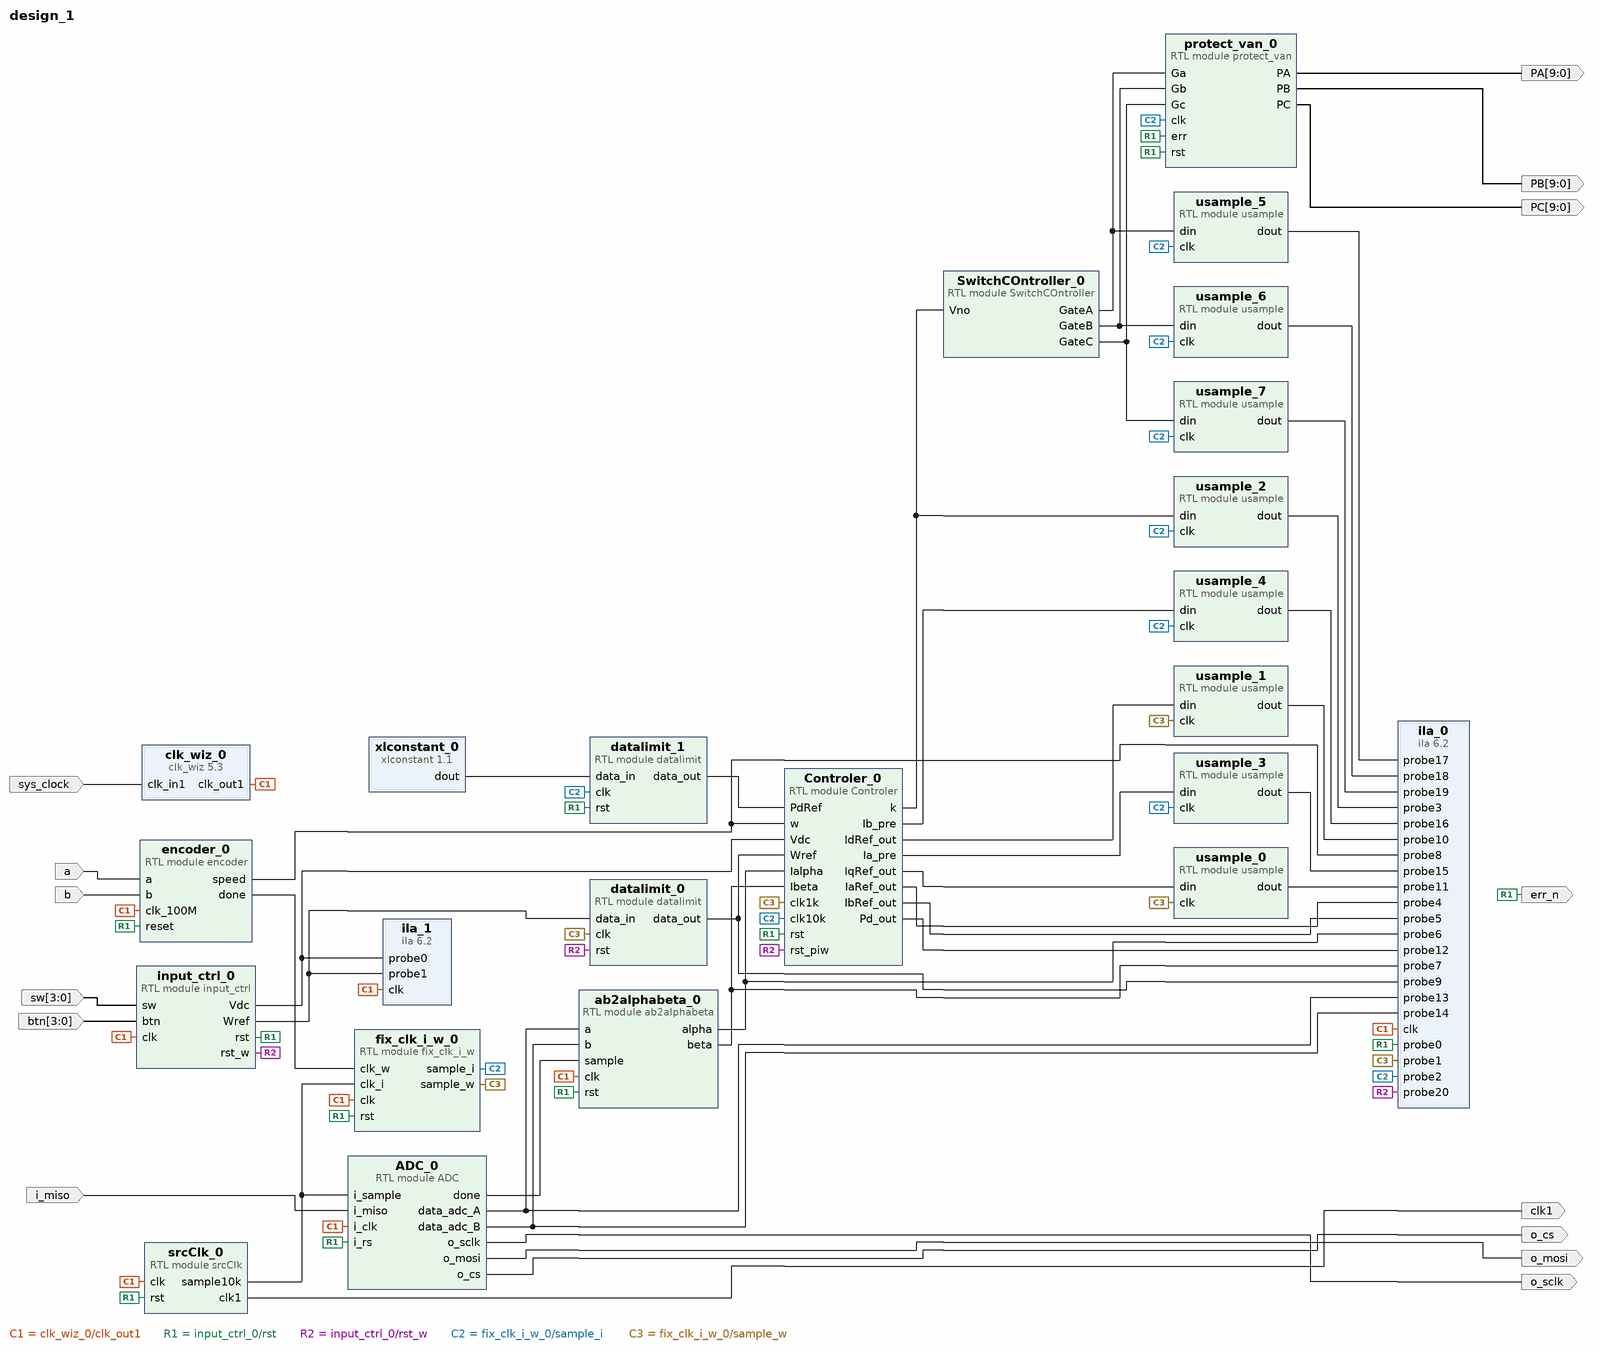
[diagram p0: block diagram of the top level]
# Vivado block design design_1, xc7z020clg400-1, Vivado 2016.4
create_bd_design design_1

create_bd_port -dir I -type clk sys_clock
set_property -dict {CONFIG.FREQ_HZ 125000000 CONFIG.PHASE 0.000} [get_bd_ports sys_clock]
create_bd_port -dir I a
create_bd_port -dir I b
create_bd_port -dir I i_miso
create_bd_port -dir O o_sclk
create_bd_port -dir O o_mosi
create_bd_port -dir O o_cs
create_bd_port -dir I -from 3 -to 0 sw
create_bd_port -dir O err_n
create_bd_port -dir O clk1
create_bd_port -dir I -from 3 -to 0 btn
create_bd_port -dir O -from 9 -to 0 PA
create_bd_port -dir O -from 9 -to 0 PB
create_bd_port -dir O -from 9 -to 0 PC

create_bd_cell -type module -reference encoder encoder_0
create_bd_cell -type ip -vlnv xilinx.com:ip:clk_wiz:5.3 clk_wiz_0
set_property -dict [list \
  CONFIG.CLKIN1_JITTER_PS 80.0 \
  CONFIG.USE_LOCKED false \
  CONFIG.USE_RESET false \
  CONFIG.MMCM_DIVCLK_DIVIDE 1 \
  CONFIG.MMCM_CLKFBOUT_MULT_F 8.000 \
  CONFIG.MMCM_CLKIN1_PERIOD 8.0 \
  CONFIG.USE_BOARD_FLOW true \
  CONFIG.CLK_IN1_BOARD_INTERFACE sys_clock \
  CONFIG.CLKOUT1_JITTER 124.615 \
  CONFIG.CLKOUT1_PHASE_ERROR 96.948 \
] [get_bd_cells clk_wiz_0]
create_bd_cell -type ip -vlnv xilinx.com:ip:xlconstant:1.1 xlconstant_0
set_property -dict {CONFIG.CONST_WIDTH 20 CONFIG.CONST_VAL 4900} [get_bd_cells xlconstant_0]
create_bd_cell -type module -reference datalimit datalimit_0
set_property -dict {CONFIG.delta 6 CONFIG.dWidth 20} [get_bd_cells datalimit_0]
create_bd_cell -type module -reference srcClk srcClk_0
create_bd_cell -type module -reference usample usample_0
create_bd_cell -type module -reference usample usample_1
create_bd_cell -type module -reference usample usample_2
set_property -dict {CONFIG.dWidth 16} [get_bd_cells usample_2]
create_bd_cell -type ip -vlnv xilinx.com:ip:ila:6.2 ila_0
set_property -dict [list \
  CONFIG.C_PROBE20_TYPE 2 \
  CONFIG.C_PROBE19_TYPE 1 \
  CONFIG.C_PROBE18_TYPE 1 \
  CONFIG.C_PROBE17_TYPE 1 \
  CONFIG.C_PROBE16_TYPE 1 \
  CONFIG.C_PROBE15_TYPE 1 \
  CONFIG.C_PROBE14_TYPE 1 \
  CONFIG.C_PROBE13_TYPE 1 \
  CONFIG.C_PROBE12_TYPE 1 \
  CONFIG.C_PROBE11_TYPE 1 \
  CONFIG.C_PROBE10_TYPE 1 \
  CONFIG.C_PROBE9_TYPE 1 \
  CONFIG.C_PROBE8_TYPE 1 \
  CONFIG.C_PROBE7_TYPE 1 \
  CONFIG.C_PROBE6_TYPE 1 \
  CONFIG.C_PROBE5_TYPE 1 \
  CONFIG.C_PROBE4_TYPE 1 \
  CONFIG.C_PROBE3_TYPE 1 \
  CONFIG.C_PROBE0_TYPE 2 \
  CONFIG.C_PROBE19_WIDTH 10 \
  CONFIG.C_PROBE18_WIDTH 10 \
  CONFIG.C_PROBE17_WIDTH 10 \
  CONFIG.C_PROBE16_WIDTH 20 \
  CONFIG.C_PROBE15_WIDTH 20 \
  CONFIG.C_PROBE14_WIDTH 20 \
  CONFIG.C_PROBE13_WIDTH 20 \
  CONFIG.C_PROBE12_WIDTH 20 \
  CONFIG.C_PROBE11_WIDTH 20 \
  CONFIG.C_PROBE10_WIDTH 20 \
  CONFIG.C_PROBE9_WIDTH 20 \
  CONFIG.C_PROBE8_WIDTH 20 \
  CONFIG.C_PROBE7_WIDTH 20 \
  CONFIG.C_PROBE6_WIDTH 20 \
  CONFIG.C_PROBE5_WIDTH 20 \
  CONFIG.C_PROBE4_WIDTH 20 \
  CONFIG.C_PROBE3_WIDTH 16 \
  CONFIG.C_DATA_DEPTH 8192 \
  CONFIG.C_NUM_OF_PROBES 21 \
  CONFIG.C_EN_STRG_QUAL 1 \
  CONFIG.C_PROBE15_MU_CNT 2 \
  CONFIG.C_PROBE14_MU_CNT 2 \
  CONFIG.C_PROBE13_MU_CNT 2 \
  CONFIG.C_PROBE12_MU_CNT 2 \
  CONFIG.C_PROBE11_MU_CNT 2 \
  CONFIG.C_PROBE10_MU_CNT 2 \
  CONFIG.C_PROBE9_MU_CNT 2 \
  CONFIG.C_PROBE8_MU_CNT 2 \
  CONFIG.C_PROBE7_MU_CNT 2 \
  CONFIG.C_PROBE6_MU_CNT 2 \
  CONFIG.C_PROBE5_MU_CNT 2 \
  CONFIG.C_PROBE4_MU_CNT 2 \
  CONFIG.C_PROBE3_MU_CNT 2 \
  CONFIG.C_PROBE2_MU_CNT 2 \
  CONFIG.C_PROBE1_MU_CNT 2 \
  CONFIG.C_PROBE0_MU_CNT 2 \
  CONFIG.ALL_PROBE_SAME_MU_CNT 2 \
  CONFIG.C_ENABLE_ILA_AXI_MON false \
  CONFIG.C_MONITOR_TYPE Native \
] [get_bd_cells ila_0]
create_bd_cell -type module -reference fix_clk_i_w fix_clk_i_w_0
create_bd_cell -type ip -vlnv xilinx.com:ip:ila:6.2 ila_1
set_property -dict [list \
  CONFIG.C_PROBE1_TYPE 1 \
  CONFIG.C_PROBE0_TYPE 1 \
  CONFIG.C_PROBE1_WIDTH 20 \
  CONFIG.C_PROBE0_WIDTH 20 \
  CONFIG.C_NUM_OF_PROBES 2 \
  CONFIG.C_ENABLE_ILA_AXI_MON false \
  CONFIG.C_MONITOR_TYPE Native \
] [get_bd_cells ila_1]
create_bd_cell -type module -reference datalimit datalimit_1
set_property -dict {CONFIG.delta 16 CONFIG.dWidth 20} [get_bd_cells datalimit_1]
create_bd_cell -type module -reference SwitchCOntroller SwitchCOntroller_0
create_bd_cell -type module -reference protect_van protect_van_0
create_bd_cell -type module -reference usample usample_3
create_bd_cell -type module -reference usample usample_4
create_bd_cell -type module -reference usample usample_5
set_property -dict {CONFIG.dWidth 10} [get_bd_cells usample_5]
create_bd_cell -type module -reference usample usample_6
set_property -dict {CONFIG.dWidth 10} [get_bd_cells usample_6]
create_bd_cell -type module -reference usample usample_7
set_property -dict {CONFIG.dWidth 10} [get_bd_cells usample_7]
create_bd_cell -type module -reference ADC ADC_0
set_property -dict {CONFIG.CONTROL2 0x9c30} [get_bd_cells ADC_0]
create_bd_cell -type module -reference Controler Controler_0
create_bd_cell -type module -reference ab2alphabeta ab2alphabeta_0
create_bd_cell -type module -reference input_ctrl input_ctrl_0

# ---- connections ----

connect_bd_net [get_bd_pins encoder_0/speed] [get_bd_pins ila_0/probe8] [get_bd_pins Controler_0/w]
connect_bd_net [get_bd_pins clk_wiz_0/clk_out1] \
  [get_bd_pins encoder_0/clk_100M] [get_bd_pins srcClk_0/clk] [get_bd_pins ila_0/clk] [get_bd_pins fix_clk_i_w_0/clk] \
  [get_bd_pins ila_1/clk] [get_bd_pins ADC_0/i_clk] [get_bd_pins ab2alphabeta_0/clk] [get_bd_pins input_ctrl_0/clk]
connect_bd_net [get_bd_ports sys_clock] [get_bd_pins clk_wiz_0/clk_in1]
connect_bd_net [get_bd_ports a] [get_bd_pins encoder_0/a]
connect_bd_net [get_bd_ports b] [get_bd_pins encoder_0/b]
connect_bd_net [get_bd_ports i_miso] [get_bd_pins ADC_0/i_miso]
connect_bd_net [get_bd_pins ADC_0/o_sclk] [get_bd_ports o_sclk]
connect_bd_net [get_bd_pins ADC_0/o_mosi] [get_bd_ports o_mosi]
connect_bd_net [get_bd_pins ADC_0/o_cs] [get_bd_ports o_cs]
connect_bd_net [get_bd_pins encoder_0/done] [get_bd_pins fix_clk_i_w_0/clk_w]
connect_bd_net [get_bd_ports sw] [get_bd_pins input_ctrl_0/sw]
connect_bd_net [get_bd_pins input_ctrl_0/rst] \
  [get_bd_ports err_n] [get_bd_pins encoder_0/reset] [get_bd_pins srcClk_0/rst] [get_bd_pins ila_0/probe0] \
  [get_bd_pins fix_clk_i_w_0/rst] [get_bd_pins datalimit_1/rst] [get_bd_pins protect_van_0/rst] \
  [get_bd_pins protect_van_0/err] [get_bd_pins ADC_0/i_rs] [get_bd_pins Controler_0/rst] [get_bd_pins ab2alphabeta_0/rst]
connect_bd_net [get_bd_pins input_ctrl_0/rst_w] [get_bd_pins datalimit_0/rst] [get_bd_pins Controler_0/rst_piw] [get_bd_pins ila_0/probe20]
connect_bd_net [get_bd_pins ADC_0/data_adc_A] [get_bd_pins ila_0/probe13] [get_bd_pins ab2alphabeta_0/a]
connect_bd_net [get_bd_pins ADC_0/data_adc_B] [get_bd_pins ila_0/probe14] [get_bd_pins ab2alphabeta_0/b]
connect_bd_net [get_bd_pins ab2alphabeta_0/alpha] [get_bd_pins ila_0/probe6] [get_bd_pins Controler_0/Ialpha]
connect_bd_net [get_bd_pins ab2alphabeta_0/beta] [get_bd_pins ila_0/probe7] [get_bd_pins Controler_0/Ibeta]
connect_bd_net [get_bd_pins input_ctrl_0/Wref] [get_bd_pins datalimit_0/data_in] [get_bd_pins ila_1/probe1]
connect_bd_net [get_bd_pins datalimit_0/data_out] [get_bd_pins ila_0/probe9] [get_bd_pins Controler_0/Wref]
connect_bd_net [get_bd_pins srcClk_0/clk1] [get_bd_ports clk1]
connect_bd_net [get_bd_pins Controler_0/k] [get_bd_pins usample_2/din] [get_bd_pins SwitchCOntroller_0/Vno]
connect_bd_net [get_bd_pins usample_2/dout] [get_bd_pins ila_0/probe3]
connect_bd_net [get_bd_pins usample_1/dout] [get_bd_pins ila_0/probe10]
connect_bd_net [get_bd_pins usample_0/dout] [get_bd_pins ila_0/probe11]
connect_bd_net [get_bd_pins ADC_0/done] [get_bd_pins ab2alphabeta_0/sample]
connect_bd_net [get_bd_pins SwitchCOntroller_0/GateA] [get_bd_pins protect_van_0/Ga] [get_bd_pins usample_5/din]
connect_bd_net [get_bd_pins SwitchCOntroller_0/GateB] [get_bd_pins protect_van_0/Gb] [get_bd_pins usample_6/din]
connect_bd_net [get_bd_pins SwitchCOntroller_0/GateC] [get_bd_pins protect_van_0/Gc] [get_bd_pins usample_7/din]
connect_bd_net [get_bd_pins srcClk_0/sample10k] [get_bd_pins fix_clk_i_w_0/clk_i] [get_bd_pins ADC_0/i_sample]
connect_bd_net [get_bd_ports btn] [get_bd_pins input_ctrl_0/btn]
connect_bd_net [get_bd_pins input_ctrl_0/Vdc] [get_bd_pins ila_1/probe0] [get_bd_pins Controler_0/Vdc]
connect_bd_net [get_bd_pins xlconstant_0/dout] [get_bd_pins datalimit_1/data_in]
connect_bd_net [get_bd_pins protect_van_0/PA] [get_bd_ports PA]
connect_bd_net [get_bd_pins protect_van_0/PB] [get_bd_ports PB]
connect_bd_net [get_bd_pins protect_van_0/PC] [get_bd_ports PC]
connect_bd_net [get_bd_pins datalimit_1/data_out] [get_bd_pins Controler_0/PdRef]
connect_bd_net [get_bd_pins fix_clk_i_w_0/sample_i] \
  [get_bd_pins protect_van_0/clk] [get_bd_pins usample_2/clk] [get_bd_pins ila_0/probe2] [get_bd_pins datalimit_1/clk] \
  [get_bd_pins usample_3/clk] [get_bd_pins usample_4/clk] [get_bd_pins usample_5/clk] [get_bd_pins usample_6/clk] \
  [get_bd_pins usample_7/clk] [get_bd_pins Controler_0/clk10k]
connect_bd_net [get_bd_pins Controler_0/IqRef_out] [get_bd_pins usample_0/din]
connect_bd_net [get_bd_pins Controler_0/IdRef_out] [get_bd_pins usample_1/din]
connect_bd_net [get_bd_pins Controler_0/IaRef_out] [get_bd_pins ila_0/probe4]
connect_bd_net [get_bd_pins Controler_0/IbRef_out] [get_bd_pins ila_0/probe5]
connect_bd_net [get_bd_pins Controler_0/Pd_out] [get_bd_pins ila_0/probe12]
connect_bd_net [get_bd_pins fix_clk_i_w_0/sample_w] \
  [get_bd_pins datalimit_0/clk] [get_bd_pins ila_0/probe1] [get_bd_pins usample_1/clk] [get_bd_pins usample_0/clk] \
  [get_bd_pins Controler_0/clk1k]
connect_bd_net [get_bd_pins Controler_0/Ia_pre] [get_bd_pins usample_3/din]
connect_bd_net [get_bd_pins Controler_0/Ib_pre] [get_bd_pins usample_4/din]
connect_bd_net [get_bd_pins usample_3/dout] [get_bd_pins ila_0/probe15]
connect_bd_net [get_bd_pins usample_4/dout] [get_bd_pins ila_0/probe16]
connect_bd_net [get_bd_pins usample_5/dout] [get_bd_pins ila_0/probe17]
connect_bd_net [get_bd_pins usample_6/dout] [get_bd_pins ila_0/probe18]
connect_bd_net [get_bd_pins usample_7/dout] [get_bd_pins ila_0/probe19]

validate_bd_design
save_bd_design
